# Altium schematic sheet PS.SchDoc
size A4
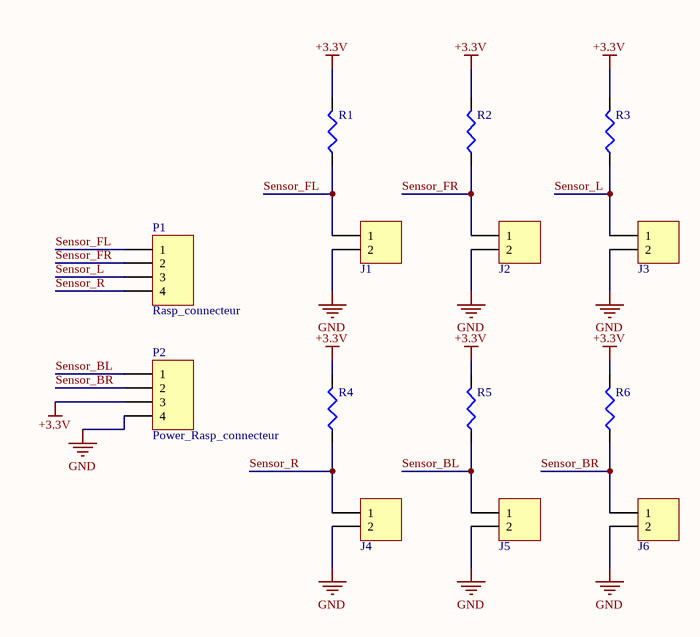
[diagram p0: PS.SchDoc]

## Parts
J1  Connecteur 2  [Header_2Ecam]  (value not drawn)
J2  Connecteur 2  [Header_2Ecam]  (value not drawn)
J3  Connecteur 2  [Header_2Ecam]  (value not drawn)
J4  Connecteur 2  [Header_2Ecam]  (value not drawn)
J5  Connecteur 2  [Header_2Ecam]  (value not drawn)
J6  Connecteur 2  [Header_2Ecam]  (value not drawn)
P1  Rasp_connecteur  [Header4_ecam]
P2  Power_Rasp_connecteur  [Header4_ecam]
R1  Résistance  [AXIAL-0.3]  (value not drawn)
R2  Résistance  [AXIAL-0.3]  (value not drawn)
R3  Résistance  [AXIAL-0.3]  (value not drawn)
R4  Résistance  [AXIAL-0.3]  (value not drawn)
R5  Résistance  [AXIAL-0.3]  (value not drawn)
R6  Résistance  [AXIAL-0.3]  (value not drawn)

## Nets
+3.3V: P2.3 R1.2 R2.2 R3.2 R4.2 R5.2 R6.2
GND: J1.2 J2.2 J3.2 J4.2 J5.2 J6.2 P2.4
Sensor_BL: J5.1 P2.1 R5.1
Sensor_BR: J6.1 P2.2 R6.1
Sensor_FL: J1.1 P1.1 R1.1
Sensor_FR: J2.1 P1.2 R2.1
Sensor_L: J3.1 P1.3 R3.1
Sensor_R: J4.1 P1.4 R4.1

## Library data of the parts
J1-J6 = Connecteur 2: Connecteur; Designer: ECAM 2005; Supplier: ECAM; Type: Connecteur à vis
P1 P2 = Header 4: Header, 4-Pin; LatestRevisionDate: 17-Jul-2002; LatestRevisionNote: Re-released for DXP Platform.; Publisher: Altium Limited; Supplier: Farnell 9731164
R1-R6 = Résistance: Résistance standard; Designer: ECAM 2005; Type: Résistance standard